# Altium schematic sheet RFID.SchDoc
size 292 x 193 mm; Opracowal: Krzysztof Dobosz; projRevision: MM; Author: Krzysztof Dobosz; CompanyName: Politechnika Warszawska; Organization: EITI; Address1: Nowowiejska 15/19; Address2: 00-665 Warszawa; Revision: MM; SheetNumber: 4; SheetTotal: 8; HTTPLink: www.pw.edu.pl
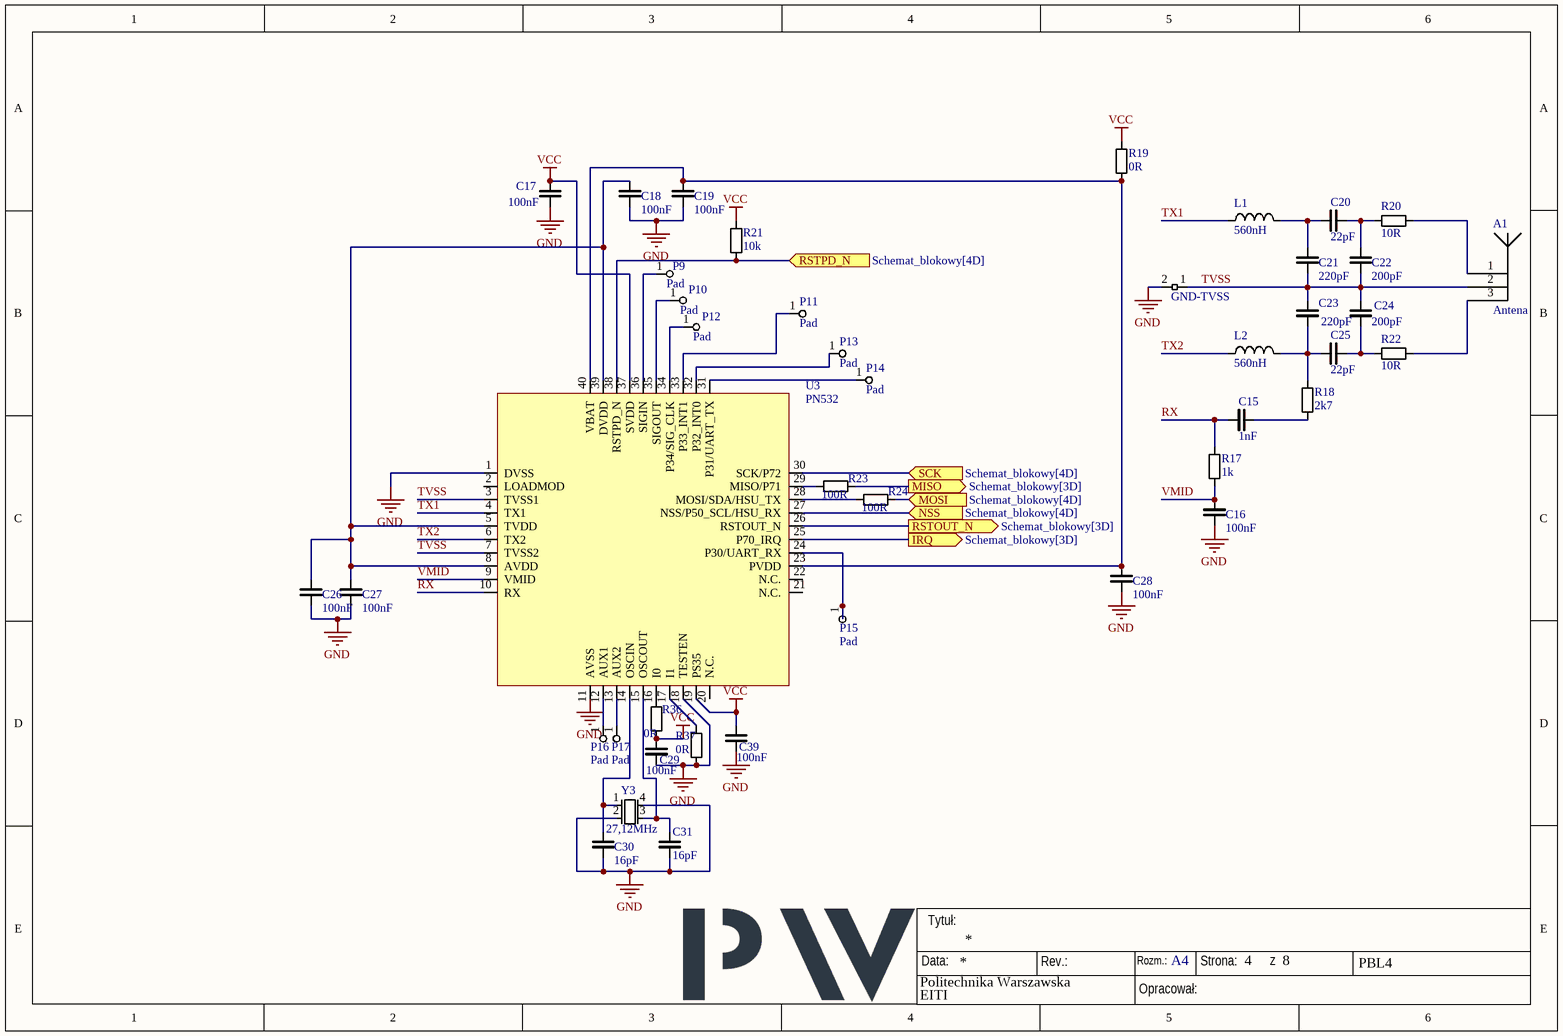
[diagram p0: RFID.SchDoc]

## Parts
?  GND-TVSS  [GND-TVSS]  (net tie, no BOM)
A1  Antena  [Antena_RFID]  (net tie, no BOM)
C15  1nF  [0603_CAP]
C16  100nF  [0603_CAP]
C17  100nF  [0603_CAP]
C18  100nF  [0603_CAP]
C19  100nF  [0603_CAP]
C20  22pF  [0603_CAP]
C21  220pF  [0603_CAP]
C22  200pF  [0603_CAP]
C23  220pF  [0603_CAP]
C24  200pF  [0603_CAP]
C25  22pF  [0603_CAP]
C26  100nF  [0603_CAP]
C27  100nF  [0603_CAP]
C28  100nF  [0603_CAP]
C29  100nF  [0603_CAP]
C30  16pF  [0603_CAP]
C31  16pF  [0603_CAP]
C39  100nF  [0603_CAP]
L1  560nH  [0603_IND]
L2  560nH  [0603_IND]
P9  Pad  [pad]  (no BOM)
P10  Pad  [pad]  (no BOM)
P11  Pad  [pad]  (no BOM)
P12  Pad  [pad]  (no BOM)
P13  Pad  [pad]  (no BOM)
P14  Pad  [pad]  (no BOM)
P15  Pad  [pad]  (no BOM)
P16  Pad  [pad]  (no BOM)
P17  Pad  [pad]  (no BOM)
R17  1k  [0603_RES]
R18  2k7  [0603_RES]
R19  0R  [0603_RES]
R20  10R  [0603_RES]
R21  10k  [0603_RES]
R22  10R  [0603_RES]
R23  100R  [0603_RES]
R24  100R  [0603_RES]
R36  0R  [0603_RES]
R37  0R  [0603_RES]
U3  PN532  [QFN40G-0.5-6X6MM]
Y3  27,12MHz  [XTAL_ABM8-27.120MHZ-10-D1G-T]

## Ports
IRQ (out, see Schemat_blokowy[3D]), MISO (out, see Schemat_blokowy[3D]), MOSI (in, see Schemat_blokowy[4D]), NSS (in, see Schemat_blokowy[4D]), RSTOUT_N (out, see Schemat_blokowy[3D]), RSTPD_N (in, see Schemat_blokowy[4D]), SCK (in, see Schemat_blokowy[4D])

## Nets
GND: ?.2 C16.1 C17.1 C18.1 C19.1 C26.1 C27.1 C28.1 C29.1 C30.1 C31.1 C39.1 R37.1 U3.1(DVSS) U3.11(AVSS) U3.18(TESTEN) Y3.2 Y3.4
VCC: C17.2 C29.2 C39.2 R19.2 R21.2 R36.1 U3.19(PS35) U3.37(SVDD)
IRQ: U3.25(P70_IRQ) ; port IRQ
MISO: R23.2 ; port MISO
MOSI: R24.2 ; port MOSI
NSS: U3.27(NSS/P50_SCL/HSU_RX) ; port NSS
RSTOUT_N: U3.26(RSTOUT_N) ; port RSTOUT_N
RSTPD_N: R21.1 U3.38(RSTPD_N) ; port RSTPD_N
RX: C15.1 R17.2 U3.10(RX)
SCK: U3.30(SCK/P72) ; port SCK
TVSS: ?.1 A1.2 C21.1 C22.1 C23.2 C24.2 U3.3(TVSS1) U3.7(TVSS2)
TX1: L1.1 U3.4(TX1)
TX2: L2.1 U3.6(TX2)
VMID: C16.2 R17.1 U3.9(VMID)
NetA1_1: A1.1 R20.1
NetA1_3: A1.3 R22.1
NetC15_2: C15.2 R18.1
NetC18_2: C18.2 C26.2 C27.2 U3.5(TVDD) U3.8(AVDD) U3.39(DVDD)
NetC19_2: C19.2 C28.2 R19.1 U3.23(PVDD) U3.40(VBAT)
NetC20_1: C20.1 C22.2 R20.2
NetC20_2: C20.2 C21.2 L1.2
NetC23_1: C23.1 C25.2 L2.2 R18.2
NetC24_1: C24.1 C25.1 R22.2
NetC30_2: C30.2 U3.14(OSCIN) Y3.1
NetC31_2: C31.2 U3.15(OSCOUT) Y3.3
NetP9_1: P9.1 U3.36(SIGIN)
NetP10_1: P10.1 U3.35(SIGOUT)
NetP11_1: P11.1 U3.33(P33_INT1)
NetP12_1: P12.1 U3.34(P34/SIG_CLK)
NetP13_1: P13.1 U3.32(P32_INT0)
NetP14_1: P14.1 U3.31(P31/UART_TX)
NetP15_1: P15.1 U3.24(P30/UART_RX)
NetP16_1: P16.1 U3.12(AUX1)
NetP17_1: P17.1 U3.13(AUX2)
NetR23_1: R23.1 U3.29(MISO/P71)
NetR24_1: R24.1 U3.28(MOSI/SDA/HSU_TX)
NetR36_2: R36.2 U3.16(I0)
NetR37_2: R37.2 U3.17(I1)

Not connected (* = marked no-connect by the designer): U3 2(LOADMOD) 20(N.C.) 21(N.C.) 22(N.C.)

## Notes on the sheet
- Data:
- Tytuł:
- Rev.:
- Rozm.:
- A4
- Strona:
- z
- PBL4
- Opracował:

## Library data of the parts
C15-C31 C39 = Cap: Ceramic capacitor
  C15: Value: 1nF
  C16-C19 C26-C29 C39: Value: 100nF
  C20 C25: Value: 22pF
  C21 C23: Value: 220pF
  C22 C24: Value: 200pF
  C30 C31: Value: 16pF
L1 L2 = Inductor: PartNumber: CS160808-R56K; Value: 560nH; Link: https://www.digikey.pl/en/products/detail/bourns-inc/CS160808-R56K/3782656?_gl=1*10p3aaq*_up*MQ..*_gs*MQ..&gclid=Cj0KCQjwqcO_BhDaARIsACz62vPoBc739cp1REhPwRacIq9Hmi_6DHVVJt4UIt_29A6Hw2SO46MFMW8aApgZEALw_wcB&gclsrc=aw.ds
R17-R24 R36 R37 = RES: Resistor
  R17: Value: 1k
  R18: Value: 2k7
  R19 R36 R37: Value: 0R
  R20 R22: Value: 10R
  R21: Value: 10k
  R23 R24: Value: 100R
U3 = PN532: RFID module; PartNumber: PN5321A3HN/C106,55; Link: https://www.digikey.pl/en/products/detail/nxp-usa-inc/PN5321A3HN-C106-55/2296487
Y3 = Oscylator4: Oscilator; PartNumber: ABM8-27.120MHZ-10-D1G-T; Value: 27,12MHz; Link: https://www.digikey.pl/en/products/detail/abracon-llc/ABM8-27-120MHZ-10-D1G-T/8582027?_gl=1%2A1j4zvvg%2A_up%2AMQ..%2A_gs%2AMQ..&gclid=Cj0KCQjwtJ6_BhDWARIsAGanmKdDq7PmRTSwRQOEO6Y2chDsJ8ztLHAI7vvkfzRwrFQTKCYtsUalh8YaArHxEALw_wcB&gclsrc=aw.ds&fbclid=IwZXh0bgNhZW0CMTEAAR7Ivqi7CRUEsP8rOnd4--mHHE_K_pobXq-Us6J-BY0xbOx55-b20eDGrpVyWg_aem_WjV6ZaoX7HlUqguWX5el7Q